# Altium schematic sheet PortSplitters.SchDoc
size A; Organization: Altium Limited; Address1: L3, 12a Rodborough Rd; Address2: Frenchs Forest; Address3: NSW; Address4: Australia 2086; DocumentNumber: 2; SheetNumber: 2; SheetTotal: 6
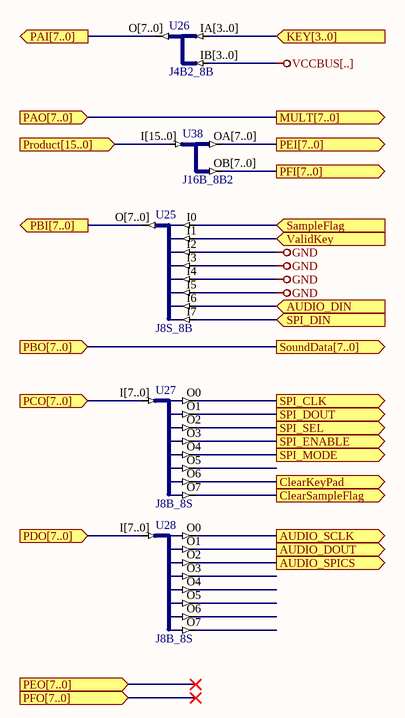
[diagram p0: PortSplitters.SchDoc]

## Parts
U25  J8S_8B
U26  J4B2_8B
U27  J8B_8S
U28  J8B_8S
U38  J16B_8B2

## Ports
AUDIO_DIN (in), AUDIO_DOUT (out), AUDIO_SCLK (out), AUDIO_SPICS (out), ClearKeyPad (out), ClearSampleFlag (out), KEY[3..0] (in), MULT[7..0] (out), PAI[7..0] (out), PAO[7..0] (in), PBI[7..0] (out), PBO[7..0] (in), PCO[7..0] (in), PDO[7..0] (in), PEI[7..0] (out), PEO[7..0] (in), PFI[7..0] (out), PFO[7..0] (in), Product[15..0] (in), SampleFlag (in), SoundData[7..0] (out), SPI_CLK (out), SPI_DIN (in), SPI_DOUT (out), SPI_ENABLE (out), SPI_MODE (out), SPI_SEL (out), ValidKey (in)

## Nets
GND: U25.I2 U25.I3 U25.I4 U25.I5
VCCBUS[..]: U26.IB[3..0]
AUDIO_DIN: U25.I6 ; port AUDIO_DIN
AUDIO_DOUT: U28.O1 ; port AUDIO_DOUT
AUDIO_SCLK: U28.O0 ; port AUDIO_SCLK
AUDIO_SPICS: U28.O2 ; port AUDIO_SPICS
ClearKeyPad: U27.O6 ; port ClearKeyPad
ClearSampleFlag: U27.O7 ; port ClearSampleFlag
KEY[3..0]: U26.IA[3..0] ; port KEY[3..0]
PAI[7..0]: U26.O[7..0] ; port PAI[7..0]
PBI[7..0]: U25.O[7..0] ; port PBI[7..0]
PCO[7..0]: U27.I[7..0] ; port PCO[7..0]
PDO[7..0]: U28.I[7..0] ; port PDO[7..0]
PEI[7..0]: U38.OA[7..0] ; port PEI[7..0]
PFI[7..0]: U38.OB[7..0] ; port PFI[7..0]
Product[15..0]: U38.I[15..0] ; port Product[15..0]
SampleFlag: U25.I0 ; port SampleFlag
SPI_CLK: U27.O0 ; port SPI_CLK
SPI_DIN: U25.I7 ; port SPI_DIN
SPI_DOUT: U27.O1 ; port SPI_DOUT
SPI_ENABLE: U27.O3 ; port SPI_ENABLE
SPI_MODE: U27.O4 ; port SPI_MODE
SPI_SEL: U27.O2 ; port SPI_SEL
ValidKey: U25.I1 ; port ValidKey

Not connected (* = marked no-connect by the designer): U27 O5; U28 O3 O4 O5 O6 O7

## Buses and harness runs
bus port MULT[7..0] = port PAO[7..0]
bus port PBO[7..0] = port SoundData[7..0]

## Notes on the sheet
- Title
- Size:
- Date:
- A
- Number:
- Time:
- Revision:
- Sheet
- of
- File:

## Library data of the parts
U25 = J8S_8B: 8 Single pin inputs to single 8-Bit output bus; ArchiveName: GENERIC; Published: 18-Nov-2003; Publisher: Altium Limited; Core Revision: 1.00.00
U26 = J4B2_8B: 2 x 4-Bit input bus to 1 x 8-bit output bus; ArchiveName: GENERIC; Published: 18-Nov-2003; Publisher: Altium Limited; Core Revision: 1.00.00
U27 U28 = J8B_8S: 8-Bit input bus to 8 single pin outputs; ArchiveName: GENERIC; Published: 18-Nov-2003; Publisher: Altium Limited; Core Revision: 1.00.00
U38 = J16B_8B2: 1 x 16-bit input bus to 2 x 8-Bit output bus; ArchiveName: GENERIC; Published: 18-Dec-2003; Publisher: Altium Limited; Core Revision: 1.00.00